# EAGLE design transducer_breakout (EAGLE 9.6.2)
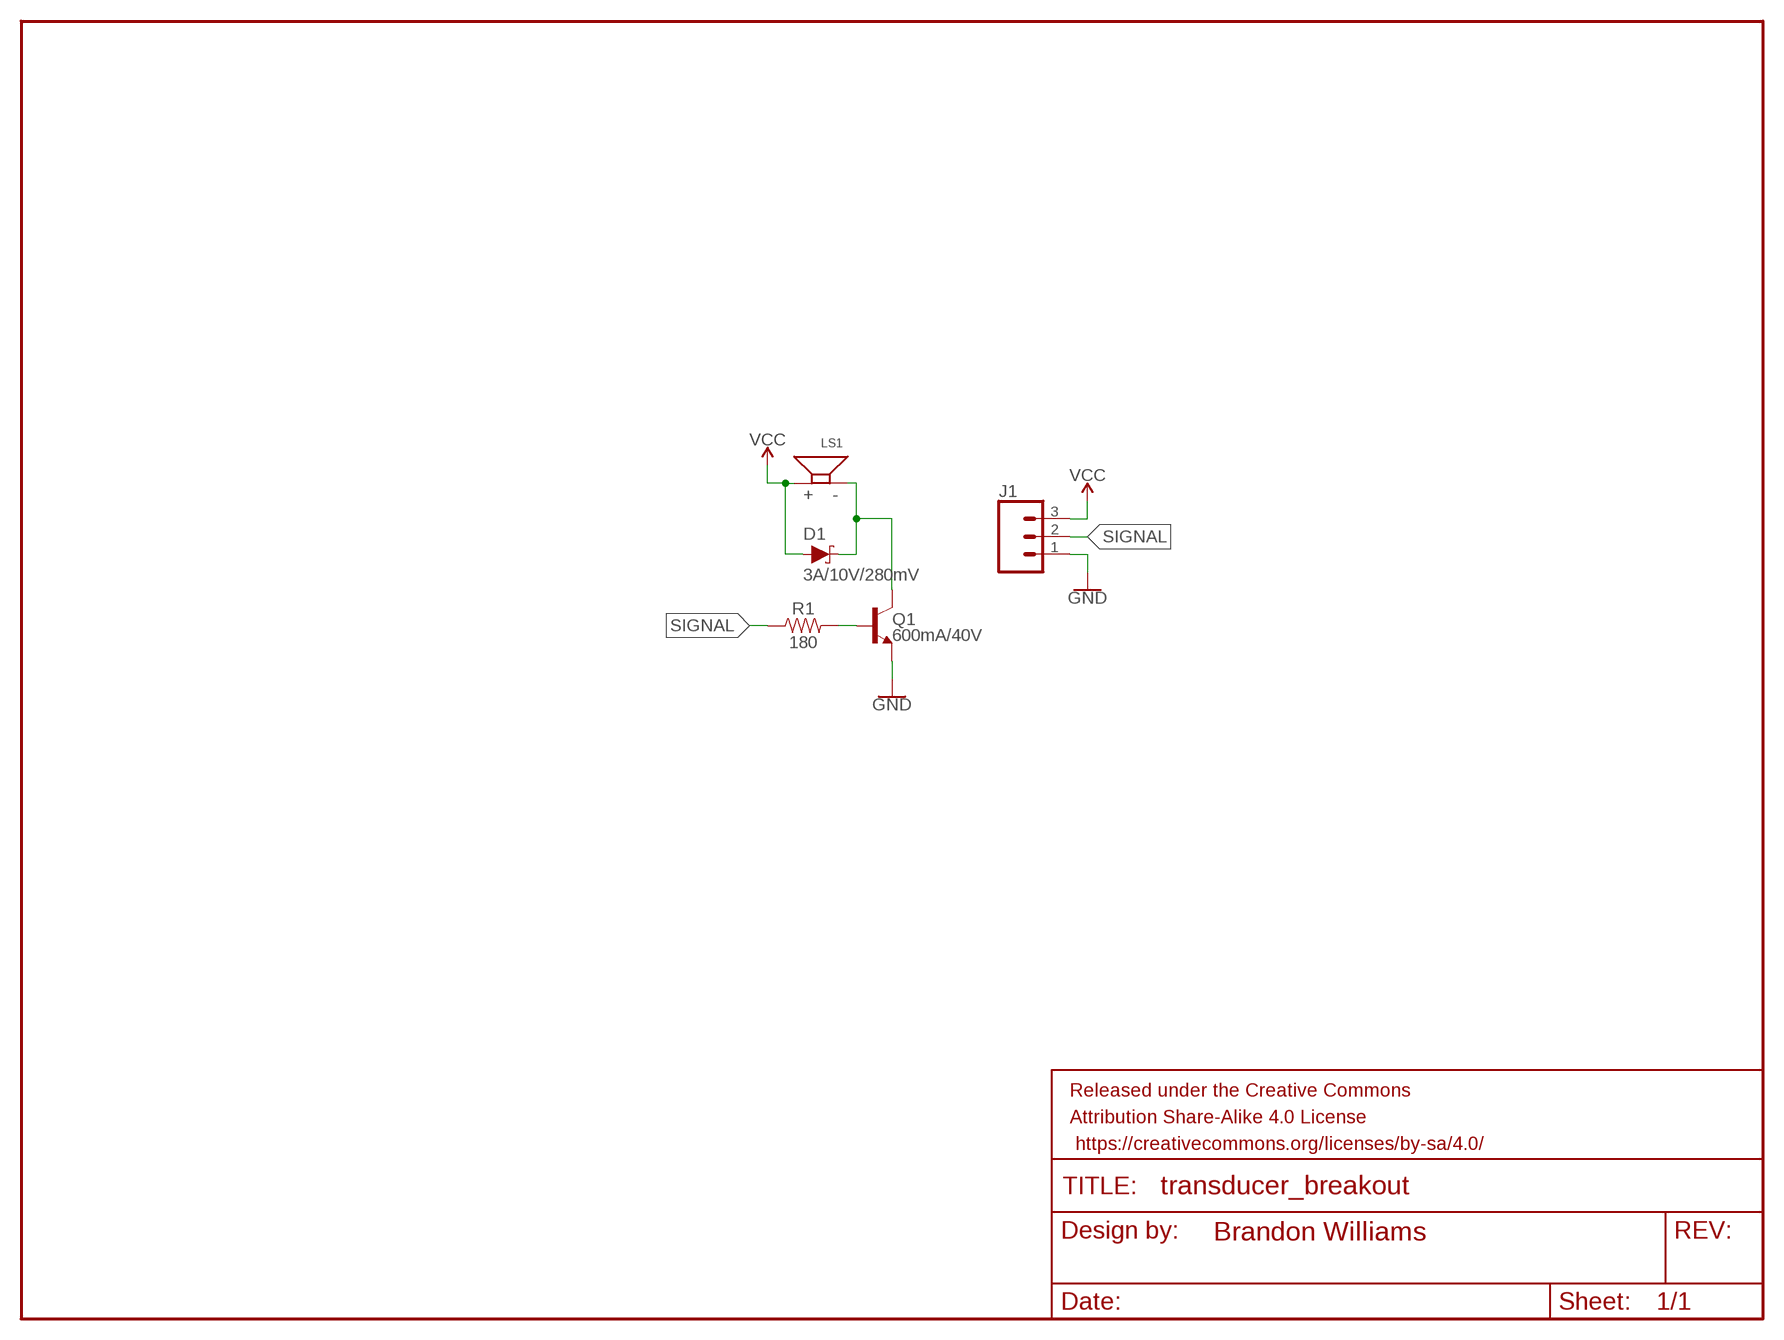
[diagram p0: schematic, sheet 1]

## Parts
D1  3A/10V/280mV  DIODE-SCHOTTKY-BAT60A  [SOD-323]
FRAME1  FRAME-LETTERNO_PACKAGE  [DUMMY]
J1  455-1750-1-ND  CONN_03  [1X03]
LS1  TRANSDUCERSMT-0340-T-R  [SMT-0340-T-R]
Q1  600mA/40V  TRANS_NPN-MMBT2222AL  [SOT23-3]
R1  180  180OHM-0603-1/10W-1%  [0603]

## Nets
GND: J1.1 Q1.2(E)
N$2: D1.C LS1.P$1(-) Q1.3(C)
N$3: Q1.1(B) R1.2
SIGNAL: J1.2 R1.1
VCC: D1.A J1.3 LS1.P$2(+)

## Library data of the parts
D1 = SparkFun-DiscreteSemi:DIODE-SCHOTTKY: Schottky diode A Schottky diode is a semiconductor diode which has a low forward voltage drop and a very fast switching action.; PROD_ID: DIO-14072
FRAME1 = SparkFun-Aesthetics:FRAME-LETTER: Schematic Frame - Letter Standard 8.5x11 US Letter frame; DESIGNER: Brandon Williams; VERSION: v01
J1 = SparkFun-Connectors:CONN_03: Multi connection point. Often used as Generic Header-pin footprint for 0.1 inch spaced/style header connections On any of the 0.1 inch spaced packages, you can populate with these: Break Away Headers - Straight <https://www.sparkfun.com/products/116> (PRT-00116) Break Away Male Headers - Right Angle <https://www.sparkfun.com/products/553> (PRT-00553) Female Headers <https://www.sparkfun.com/products/115> (PRT-00115) Break Away Headers - Machine Pin <https://www.sparkfun.com/products/117> (PRT-00117) Break Away Female Headers - Swiss Machine Pin <https://www.sparkfun.com/products/743> (PRT-00743) Stackable Header - 3 Pin (Female, 0.1") <https://www.sparkfun.com/products/13875> (PRT-13875) For SCREWTERMINALS and SPRING TERMINALS visit here: Screw Terimnals on SparkFun.com <https://www.sparkfun.com/search/results?term=Screw+Terminals> (5mm/3.5mm/2.54mm spacing) This device is also useful as a general connection point to wire up your design to another part of your project. Our various solder wires solder well into these plated through hole pads. Hook-Up Wire - Assortment (Stranded, 22 AWG) <https://www.sparkfun.com/products/11375> (PRT-11375) Hook-Up Wire - Assortment (Solid Core, 22 AWG) <https://www.sparkfun.com/products/11367> (PRT-11367) View the entire wire category on our website here <https://www.sparkfun.com/categories/141> Special notes: Molex polarized connector foot print use with SKU : PRT-08232 with associated crimp pins and housings.; PROD_ID: XXX-00000
LS1 = transducer:TRANSDUCER: SMT-0340-T-R,the smallest surface mount transducerever created! This tiny device is less than 1/6th the size of a dime and is perfect for generating audible notifications on wearables and other small electronics.
Q1 = SparkFun-DiscreteSemi:TRANS_NPN: NPN transistor Current controlled devices typically used to amplify current or used as a switch. BC547 - COM-08928 <http://www.sparkfun.com/products/8928> (TO-92 45V 100mA) (1.Collector 2.Base 3.Emitter) 2N3904 - COM-00521 <http://www.sparkfun.com/products/521> (TO-92 40V 200mA) (1.Emitter 2.Base 3.Collector) P2N2222A - COM-12852 <http://www.sparkfun.com/products/12852> (TO-92 40V 600mA) (1.Collector 2.Base 3.Emitter); PROD_ID: TRANS-08049
R1 = SparkFun-Resistors:180OHM: 180Ω resistor A resistor is a passive two-terminal electrical component that implements electrical resistance as a circuit element. Resistors act to reduce current flow, and, at the same time, act to lower voltage levels within circuits. - Wikipedia; PROD_ID: RES-08788

## Board
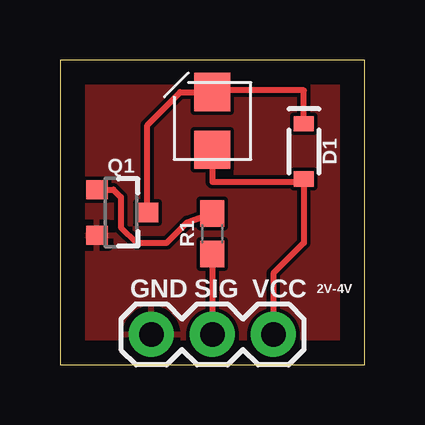
[diagram p1: board, top side]
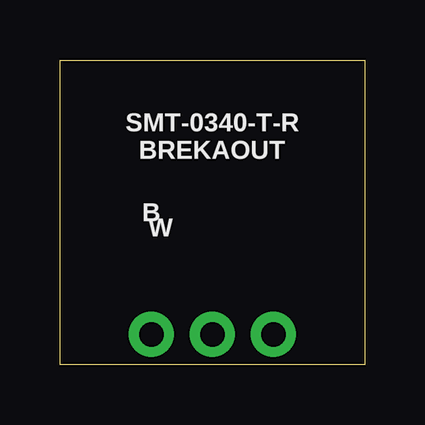
[diagram p2: board, bottom side, seen from below]

Size 12.7 x 12.7 mm. Coordinates in mm from the lower left corner, seen from the top.
Outline: 0,0 12.7,0 12.7,12.7 0,12.7 0,0
Copper layers (1*16): Top 0.035mm / dielectric 1.5mm / Bottom 0.035mm
Design rules "default": minimum track width 6mil, minimum drill 0.35mm, track to track 6mil, track to pad 6mil, pad to pad 6mil, via to via 6mil, smd to smd 6mil, copper to edge 40mil, drill to drill 6mil, minimum pad ring 10mil, minimum via ring 8mil, stop-mask expansion 4mil, vias tented up to drill 0mil, thermal gap 10mil

### Footprints (pad centres in the part's own frame; a part is rotated, then mirrored left to right if it is on the bottom)
SOD-323 = smd 0.63 x 0.83: A 1.15,0; C -1.15,0
1X03 = drill 1.016 pad 1.88: 1 0,0; 2 2.54,0; 3 5.08,0
SMT-0340-T-R = smd 1.5 x 1.6: P$1 0,1.2; P$2 0,-1.2
SOT23-3 = smd 0.8 x 0.9: 1 -0.95,-1; 2 0.95,-1; 3 0,1.1
0603 = smd 1.1 x 1: 1 -0.85,0; 2 0.85,0

### Placement (x,y rotation side)
D1  10.16,8.89 270 top
FRAME1  0,0 0 top
J1  3.81,1.27 0 top
LS1  6.35,10.16 0 top
Q1  2.54,6.35 270 top
R1  6.35,5.46 90 top

### Tracks (layer width: path | path; a pad name or v marks a point on that pad's centre or on a via)
GND
  pour Top: 0,12.7 0,0 12.7,0 12.7,12.7
N$2
  Top 0.254: Q1.3 3.64,9.99 5.01,11.36 LS1.P$1 6.42,11.43 10.16,11.43 D1.C
N$3
  Top 0.254: Q1.1 2.23,7.3 2.54,6.99 2.54,5.71 3.17,5.08 4.45,5.08 5.29,5.93 R1.2
SIGNAL
  Top 0.254: R1.1 J1.2
VCC
  Top 0.254: LS1.P$2 6.35,7.62 10.04,7.62 D1.A 10.16,5.08 8.89,3.81 J1.3

### Text on the board
tPlace: GND | SIG | VCC | 2V-4V
bPlace: SMT-0340-T-R / BREKAOUT | W | B